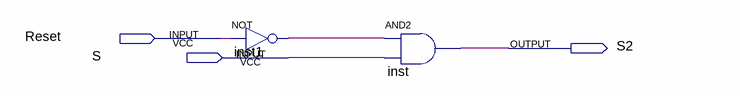
[diagram p0: schematic sheet]
// Quartus schematic moduloReset.bdf as structural Verilog: 2 symbols, 3 pins
module moduloReset (
  input  Reset,
  input  S,
  output S2
);

  wire inst1_out;

  not inst1 (inst1_out, Reset);
  and inst (S2, inst1_out, S);
endmodule
